# Altium schematic sheet SALIDA RF.SchDoc
size A3; SheetNumber: 7; SheetTotal: 7
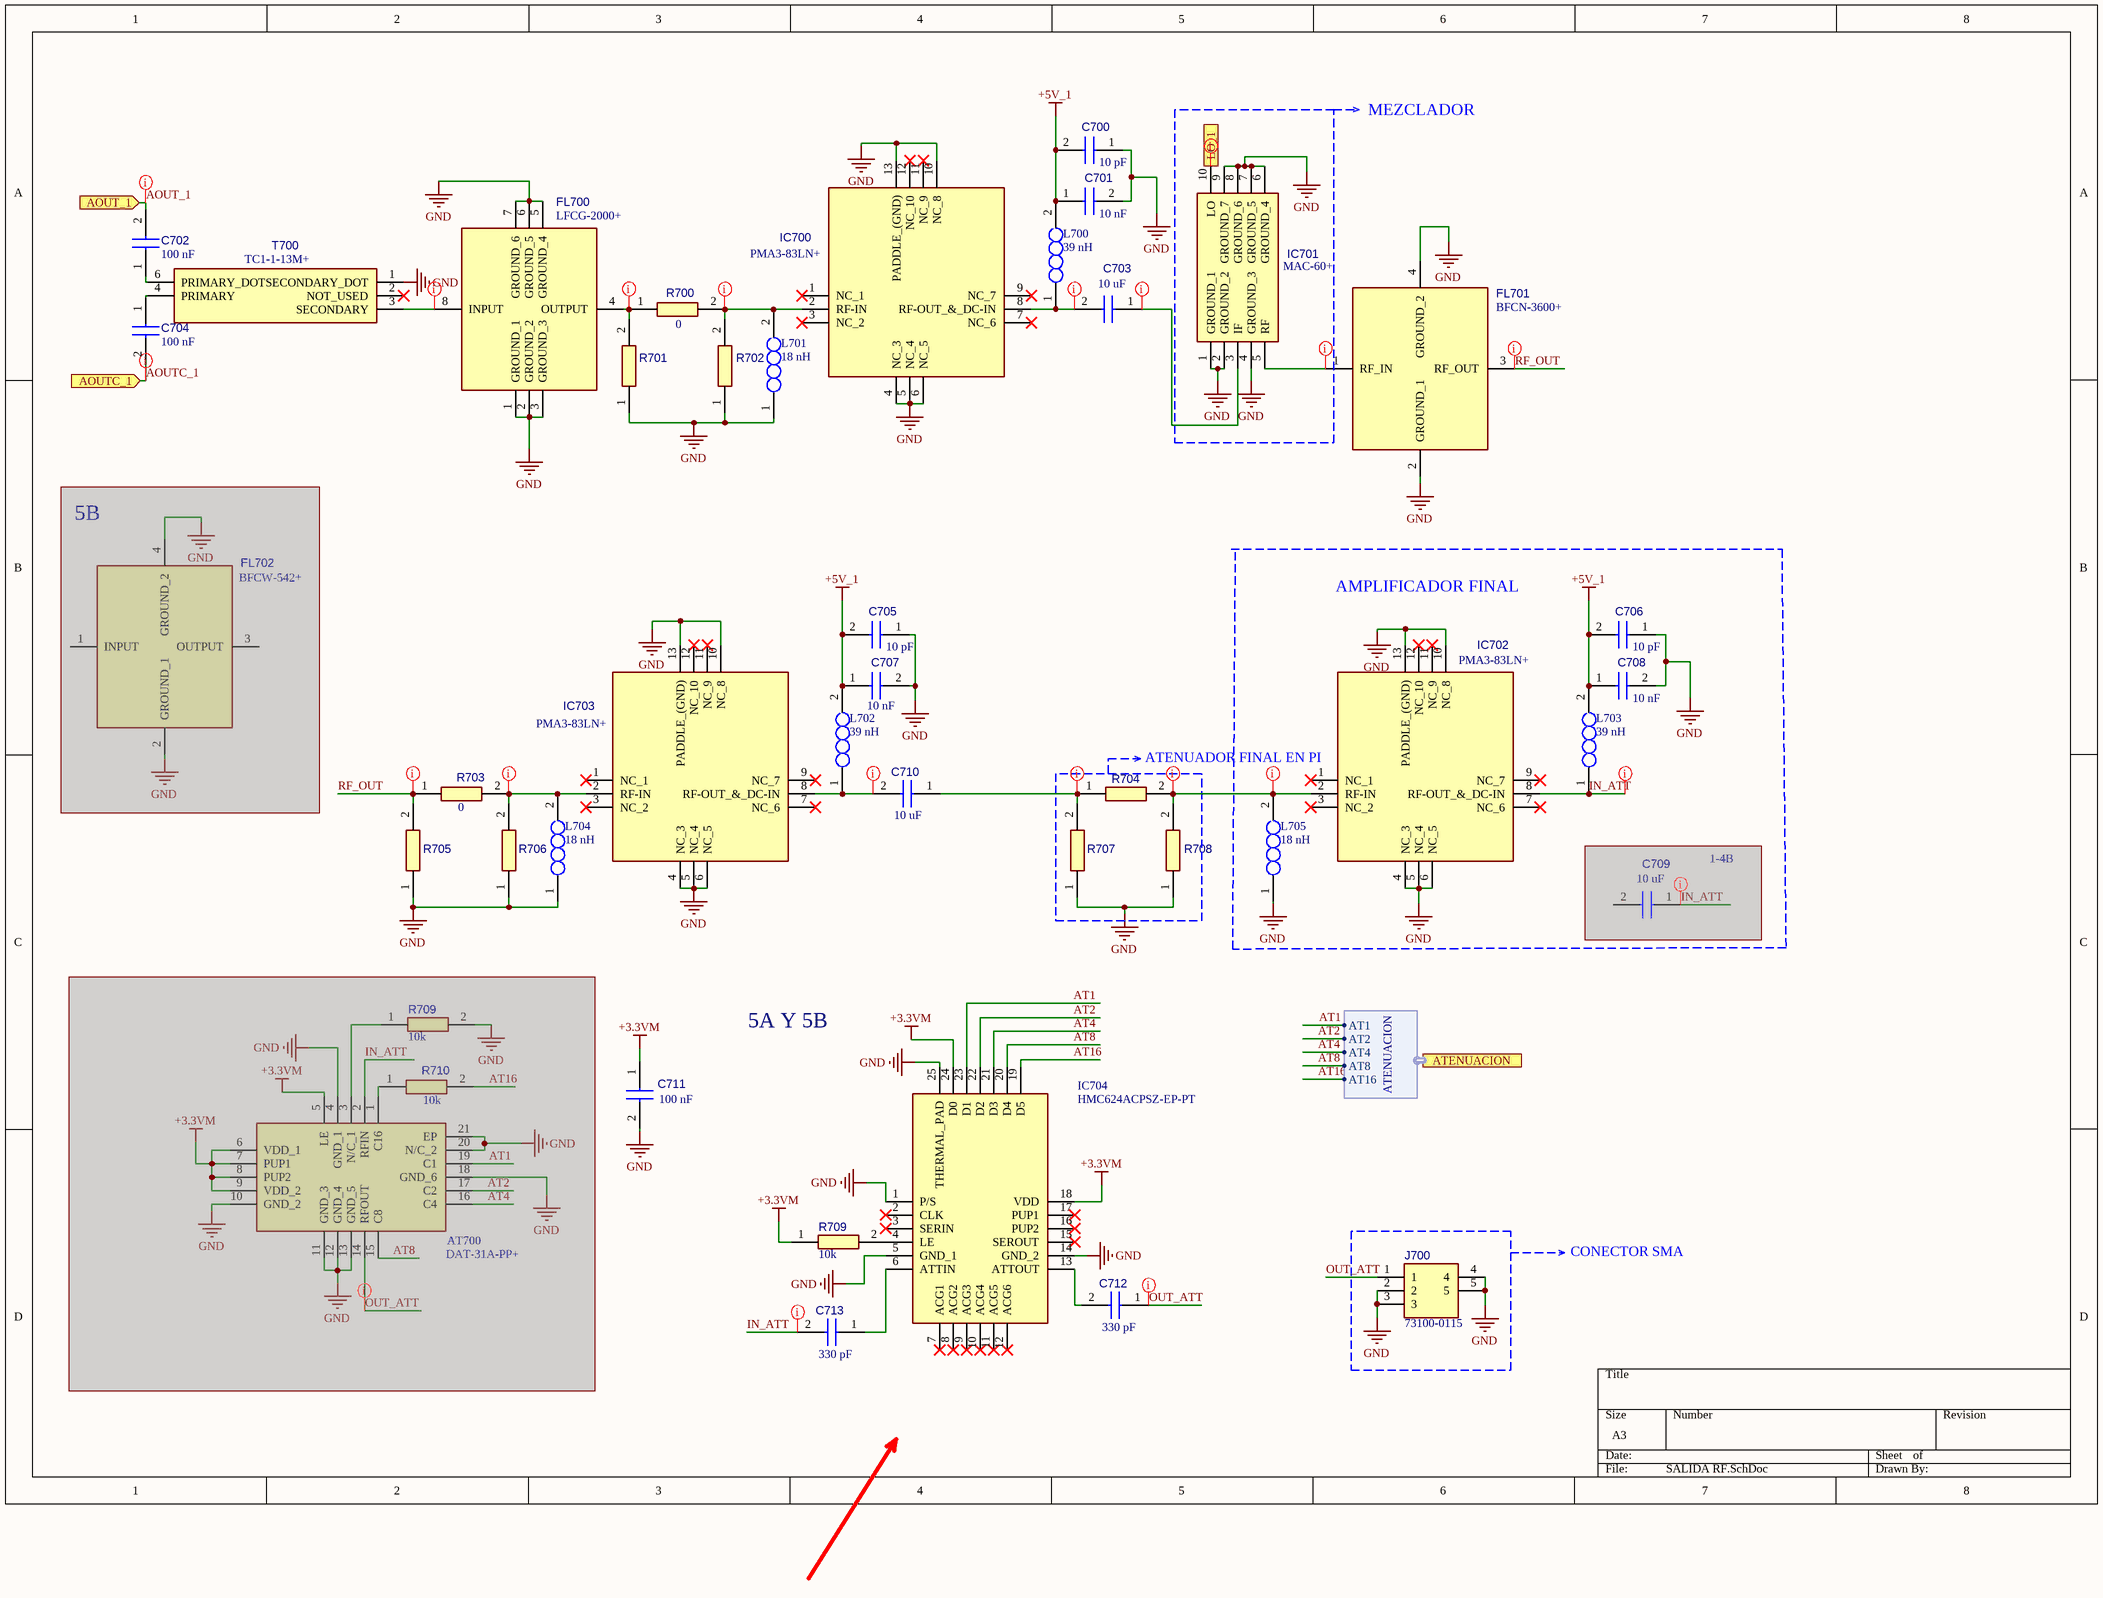
[diagram p0: SALIDA RF.SchDoc]

## Parts
(Parts that share a designator on the sheet are numbered #1, #2 ... from top to bottom, then left to right.)
AT700  DAT-31A-PP+  [QFN50P400X400X85-21N]  (masked out: inside a compile mask, not in the netlist)
C700  10 pF  [C0603]
C701  10 nF  [C0603]
C702  100 nF  [C0603]
C703  10 uF  [C0603]
C704  100 nF  [C0603]
C705  10 pF  [C0603]
C706  10 pF  [C0603]
C707  10 nF  [C0603]
C708  10 nF  [C0603]
C709  10 uF  [C0603]  (masked out: inside a compile mask, not in the netlist)
C710  10 uF  [C0603]
C711  100 nF  [C0603]
C712  330 pF  [C0603]
C713  330 pF  [C0603]
FL700  LFCG-2000+  [LFCG2000]
FL701  BFCN-3600+  [BFCN2435]
FL702  BFCW-542+  [BFCW542]  (masked out: inside a compile mask, not in the netlist)
IC700  PMA3-83LN+  [QFN51P300X300X89-13N]
IC701  MAC-60+  [MAC42]
IC702  PMA3-83LN+  [QFN51P300X300X89-13N]
IC703  PMA3-83LN+  [QFN51P300X300X89-13N]
IC704  HMC624ACPSZ-EP-PT  [QFN50P400X400X90-25N-D]
J700  73100-0115  [731000115]
L700  39 nH  [INDC1608X95N]
L701  18 nH  [INDC1608X95N]
L702  39 nH  [INDC1608X95N]
L703  39 nH  [INDC1608X95N]
L704  18 nH  [INDC1608X95N]
L705  18 nH  [INDC1608X95N]
R700  0  [RESC1608X55N]
R701  68  [RESC1608X55N]  (value not drawn)
R702  68  [RESC1608X55N]  (value not drawn)
R703  0  [RESC1608X55N]
R704  0  [RESC1608X55N]  (value not drawn)
R705  68  [RESC1608X55N]  (value not drawn)
R706  68  [RESC1608X55N]  (value not drawn)
R707  'NO SOLDAR (HAY QUE AJUSTAR)  [RESC1608X55N]  (value not drawn)
R708  'NO SOLDAR (HAY QUE AJUSTAR)  [RESC1608X55N]  (value not drawn)
R709#1  10k  [RESC1608X55N]  (masked out: inside a compile mask, not in the netlist)
R709#2  10k  [RESC1608X55N]
R710  10k  [RESC1608X55N]  (masked out: inside a compile mask, not in the netlist)
T700  TC1-1-13M+  [TC414]

## Blocks framed on the sheet
ATENUADOR FINAL EN PI: R704 R707 R708

## Ports
AOUT_1 (in), AOUTC_1 (in), ATENUACION (harness ATENUACION), LO_1 (in)

## Harnesses
ATENUACION: AT1, AT2, AT4, AT8, AT16

## Nets
+3.3VM: C711.1 IC704.18(VDD) IC704.24(D0) R709#2.1
+5V_1: C700.2 C701.1 C705.2 C706.2 C707.1 C708.1 L700.2 L702.2 L703.2
GND: C700.1 C701.2 C705.1 C706.1 C707.2 C708.2 C711.2 FL700.1(GROUND_1) FL700.2(GROUND_2) FL700.3(GROUND_3) FL700.5(GROUND_4) FL700.6(GROUND_5) FL700.7(GROUND_6) FL701.2(GROUND_1) FL701.4(GROUND_2) IC700.4(NC_3) IC700.5(NC_4) IC700.6(NC_5) IC700.10(NC_8) IC700.13(PADDLE_(GND)) IC701.1(GROUND_1) IC701.2(GROUND_2) IC701.4(GROUND_3) IC701.6(GROUND_4) IC701.7(GROUND_5) IC701.8(GROUND_6) IC701.9(GROUND_7) IC702.4(NC_3) IC702.5(NC_4) IC702.6(NC_5) IC702.10(NC_8) IC702.13(PADDLE_(GND)) IC703.4(NC_3) IC703.5(NC_4) IC703.6(NC_5) IC703.10(NC_8) IC703.13(PADDLE_(GND)) IC704.1(P/S) IC704.5(GND_1) IC704.14(GND_2) IC704.25(THERMAL_PAD) J700.2 J700.3 J700.4 J700.5 L701.1 L704.1 L705.1 R701.1 R702.1 R705.1 R706.1 R707.1 R708.1 T700.1(SECONDARY_DOT)
AOUT_1: C702.2 ; port AOUT_1
AOUTC_1: C704.2 ; port AOUTC_1
AT1: IC704.23(D1) ; port ATENUACION.AT1
AT2: IC704.22(D2) ; port ATENUACION.AT2
AT4: IC704.21(D3) ; port ATENUACION.AT4
AT8: IC704.20(D4) ; port ATENUACION.AT8
AT16: IC704.19(D5) ; port ATENUACION.AT16
IN_ATT: C713.2 IC702.8(RF-OUT_&_DC-IN) L703.1
LO_1: IC701.10(LO) ; port LO_1
OUT_ATT: C712.1 J700.1
RF_OUT: FL701.3(RF_OUT) R703.1 R705.2
NetC702_1: C702.1 T700.6(PRIMARY_DOT)
NetC703_1: C703.1 IC701.3(IF)
NetC703_2: C703.2 IC700.8(RF-OUT_&_DC-IN) L700.1
NetC704_1: C704.1 T700.4(PRIMARY)
NetC710_1: C710.1 R704.1 R707.2
NetC710_2: C710.2 IC703.8(RF-OUT_&_DC-IN) L702.1
NetC712_2: C712.2 IC704.13(ATTOUT)
NetC713_1: C713.1 IC704.6(ATTIN)
NetFL700_4: FL700.4(OUTPUT) R700.1 R701.2
NetFL700_8: FL700.8(INPUT) T700.3(SECONDARY)
NetFL701_1: FL701.1(RF_IN) IC701.5(RF)
NetIC700_2: IC700.2(RF-IN) L701.2 R700.2 R702.2
NetIC702_2: IC702.2(RF-IN) L705.2 R704.2 R708.2
NetIC703_2: IC703.2(RF-IN) L704.2 R703.2 R706.2
NetIC704_4: IC704.4(LE) R709#2.2

Not connected (* = marked no-connect by the designer): IC700 1(NC_1)* 3(NC_2)* 7(NC_6)* 9(NC_7)* 11(NC_9)* 12(NC_10)*; IC702 1(NC_1)* 3(NC_2)* 7(NC_6)* 9(NC_7)* 11(NC_9)* 12(NC_10)*; IC703 1(NC_1)* 3(NC_2)* 7(NC_6)* 9(NC_7)* 11(NC_9)* 12(NC_10)*; IC704 2(CLK)* 3(SERIN)* 7(ACG1)* 8(ACG2)* 9(ACG3)* 10(ACG4)* 11(ACG5)* 12(ACG6)* 15(SEROUT)* 16(PUP2)* 17(PUP1)*; T700 2(NOT_USED)*

## Layout directives
net class RF: (no net found under the mark), AOUT_1, AOUTC_1, IN_ATT, LO_1, NetC703_1, NetC703_2, NetC710_1, NetC710_2, NetFL700_4, NetFL700_8, NetFL701_1, NetIC700_2, NetIC702_2, NetIC703_2, OUT_ATT, RF_OUT

## Notes on the sheet
- MEZCLADOR
- (near FL702) 5B
- AMPLIFICADOR FINAL
- 1-4B
- 5A Y 5B
- CONECTOR SMA

## Library data of the parts
AT700 = DAT-31A-PP+: Attenuator or Isolator; Manufacturer_Name: Mini-Circuits; Datasheet Link: https://www.minicircuits.com/pdfs/DAT-31A-PP+.pdf; Height: 0.85mm; Manufacturer_Part_Number: DAT-31A-PP+; Mouser Part Number: 139-DAT-31A-PP+; Mouser Price/Stock: https://www.mouser.co.uk/ProductDetail/Mini-Circuits/DAT-31A-PP%2b?qs=iLbezkQI%252BsipsaaDf6EyAg%3D%3D
C700-C713 = C0603H470J5GACTU: Capacitor; Manufacturer_Name: KEMET; Datasheet Link: https://content.kemet.com/datasheets/KEM_C1001_C0G_200C_SMD.pdf; Height: 0.87mm; Manufacturer_Part_Number: C0603H470J5GACTU
FL700 = LFCG-2000+: Filter; Manufacturer_Name: Mini-Circuits; Datasheet Link: https://www.minicircuits.com/WebStore/dashboardPdf?model=LFCG-2000%2B; Height: 0.95mm; Manufacturer_Part_Number: LFCG-2000+; Mouser Part Number: 139-LFCG-2000+; Mouser Price/Stock: https://www.mouser.co.uk/ProductDetail/Mini-Circuits/LFCG-2000%2b?qs=DRkmTr78QATAEe9U%2FxoX1Q%3D%3D
FL701 = BFCN-2435+: Filter; Manufacturer_Name: Mini-Circuits; Datasheet Link: https://www.minicircuits.com/pdfs/BFCN-2435+.pdf; Height: 0.94mm; Manufacturer_Part_Number: BFCN-2435+; Mouser Part Number: 139-BFCN-2435; Mouser Price/Stock: https://www.mouser.co.uk/ProductDetail/Mini-Circuits/BFCN-2435%2b?qs=xZ%2FP%252Ba9zWqYYr0O8v0NpTg%3D%3D
FL702 = BFCW-542+: Filter; Manufacturer_Name: Mini-Circuits; Datasheet Link: https://www.minicircuits.com/pdfs/BFCW-542+.pdf; Height: 0.61mm; Manufacturer_Part_Number: BFCW-542+; Mouser Part Number: 139-BFCW-542; Mouser Price/Stock: https://www.mouser.co.uk/ProductDetail/Mini-Circuits/BFCW-542%2b?qs=xZ%2FP%252Ba9zWqZdnlamFpkC0g%3D%3D
IC700 IC702 IC703 = PMA3-83LN+: Integrated Circuit; Manufacturer_Name: Mini-Circuits; Datasheet Link: https://www.minicircuits.com/pdfs/PMA3-83LN+.pdf; Height: 0.89mm; Manufacturer_Part_Number: PMA3-83LN+; Mouser Part Number: 139-PMA3-83LN; Mouser Price/Stock: https://www.mouser.co.uk/ProductDetail/Mini-Circuits/PMA3-83LN%2b?qs=xZ%2FP%252Ba9zWqbScBj7fhbP6Q%3D%3D
IC701 = MAC-42+: Integrated Circuit; Manufacturer_Name: Mini-Circuits; Datasheet Link: https://www.minicircuits.com/WebStore/dashboardPdf?model=MAC-42%2B; Height: 1.52mm; Manufacturer_Part_Number: MAC-42+; Mouser Part Number: 139-MAC-42+; Mouser Price/Stock: https://www.mouser.co.uk/ProductDetail/Mini-Circuits/MAC-42%2b?qs=Imq1NPwxi74M3vy8bL9AzQ%3D%3D
IC704 = HMC624ACPSZ-EP-PT: Integrated Circuit; Manufacturer_Name: Analog Devices; Datasheet Link: https://www.analog.com/HMC624A/datasheet; Height: 0.9mm; Manufacturer_Part_Number: HMC624ACPSZ-EP-PT; Mouser Part Number: 584-HM624ACPSZ-EP-PT; Mouser Price/Stock: https://www.mouser.co.uk/ProductDetail/Analog-Devices/HMC624ACPSZ-EP-PT?qs=BZBei1rCqCDRspZheXUYqA%3D%3D; Arrow Part Number: HMC624ACPSZ-EP-PT; Arrow Price/Stock: https://www.arrow.com/en/products/hmc624acpsz-ep-pt/analog-devices
J700 = 73100-0115: Connector; Manufacturer_Name: Molex; Datasheet Link: https://www.molex.com/pdm_docs/sd/731000115_sd.pdf; Height: 9.57mm; Manufacturer_Part_Number: 73100-0115; Mouser Part Number: 538-73100-0115; Mouser Price/Stock: https://www.mouser.co.uk/ProductDetail/Molex/73100-0115?qs=dxVETAvtHz69wpck%252B7ItSw%3D%3D
L700-L705 = AIML-0603-100K-T: Inductor; Manufacturer_Name: ABRACON; Datasheet Link: https://abracon.com/Magnetics/new/AIML-0603.pdf; Height: 0.95mm; Manufacturer_Part_Number: AIML-0603-100K-T; Mouser Part Number: 815-AIML-0603-100KT; Mouser Price/Stock: https://www.mouser.co.uk/ProductDetail/ABRACON/AIML-0603-100K-T?qs=1vO2EIVe%252BY5tBY%252BpVVThrw%3D%3D; Arrow Part Number: AIML-0603-100K-T; Arrow Price/Stock: https://www.arrow.com/en/products/aiml-0603-100k-t/abracon?region=nac
R700 R702-R708 R709#1 R709#2 R710 = CR0603-FX-1431ELF: Resistor; Manufacturer_Name: Bourns; Datasheet Link: https://www.bourns.com/pdfs/chpreztr.pdf; Height: 0.55mm; Manufacturer_Part_Number: CR0603-FX-1431ELF; Mouser Part Number: 652-CR0603FX-1431ELF; Mouser Price/Stock: https://www.mouser.co.uk/ProductDetail/Bourns/CR0603-FX-1431ELF?qs=e7cxVwPieurCzASkAzK2%252Bg%3D%3D
R701 = CR0603-FX-1431ELF: Manufacturer_Name: Bourns; Datasheet Link: https://www.bourns.com/pdfs/chpreztr.pdf; Height: 0.55mm; Manufacturer_Part_Number: CR0603-FX-1431ELF; Mouser Part Number: 652-CR0603FX-1431ELF; Mouser Price/Stock: https://www.mouser.co.uk/ProductDetail/Bourns/CR0603-FX-1431ELF?qs=e7cxVwPieurCzASkAzK2%252Bg%3D%3D
T700 = TC1-1-13M+: Transformer; Manufacturer_Name: Mini-Circuits; Datasheet Link: https://datasheet.datasheetarchive.com/originals/distributors/Datasheets-28/DSA-546322.pdf; Height: 4.06mm; Manufacturer_Part_Number: TC1-1-13M+; Mouser Part Number: 139-TC1-1-13M; Mouser Price/Stock: https://www.mouser.co.uk/ProductDetail/Mini-Circuits/TC1-1-13M%2b?qs=xZ%2FP%252Ba9zWqYek%252BZGAF2fWg%3D%3D